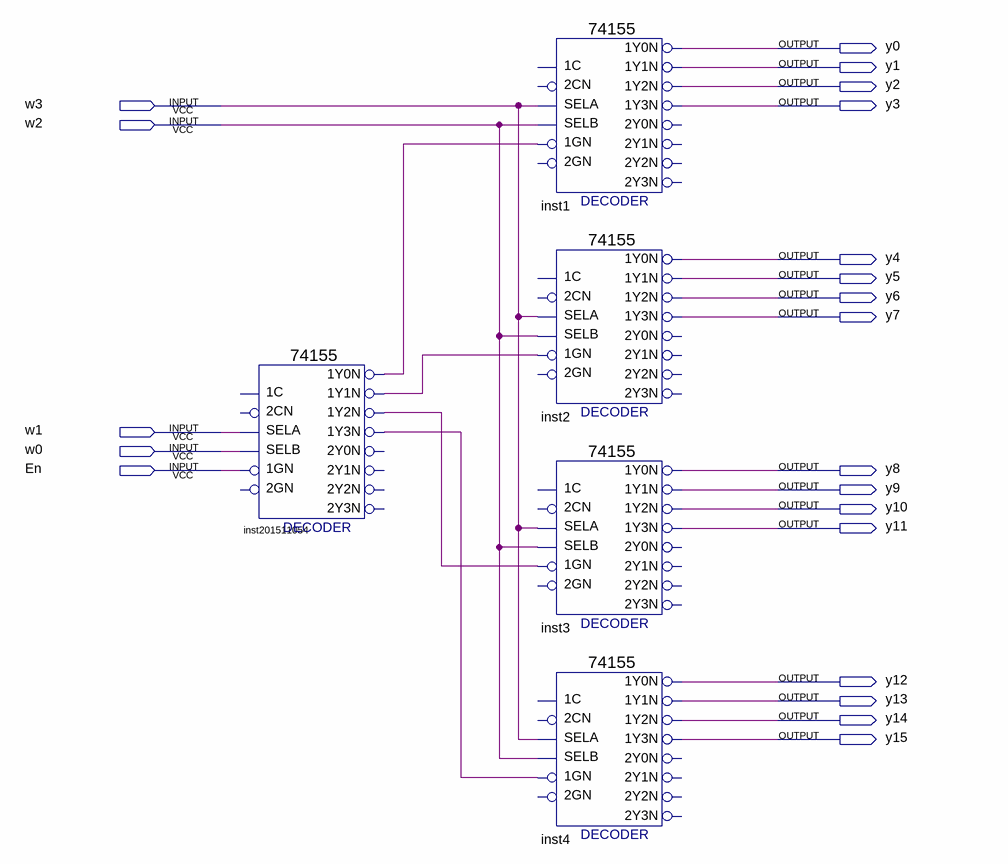
[diagram p0: schematic sheet]
// Quartus schematic lab04_1_4.bdf as structural Verilog: 5 symbols, 21 pins
module lab04_1_4 (
  input  w3,
  input  w2,
  input  w1,
  input  w0,
  input  En,
  output y0,
  output y1,
  output y2,
  output y3,
  output y4,
  output y5,
  output y6,
  output y7,
  output y8,
  output y9,
  output y10,
  output y11,
  output y12,
  output y13,
  output y14,
  output y15
);

  wire inst201511054_1y0n, inst201511054_1y1n, inst201511054_1y2n, inst201511054_1y3n;

  \74155  inst201511054 (
    .SELB(w0), .SELA(w1), .\1GN (En), .\1Y2N (inst201511054_1y2n), .\1Y1N (inst201511054_1y1n),
    .\1Y0N (inst201511054_1y0n), .\1Y3N (inst201511054_1y3n));  // open: 1C, 2CN, 2GN, 2Y1N, 2Y0N, 2Y3N, 2Y2N
  \74155  inst1 (
    .SELB(w2), .SELA(w3), .\1GN (inst201511054_1y0n), .\1Y2N (y2), .\1Y1N (y1), .\1Y0N (y0), .\1Y3N (y3));  // open: 1C, 2CN, 2GN, 2Y1N, 2Y0N, 2Y3N, 2Y2N
  \74155  inst2 (
    .SELB(w2), .SELA(w3), .\1GN (inst201511054_1y1n), .\1Y2N (y6), .\1Y1N (y5), .\1Y0N (y4), .\1Y3N (y7));  // open: 1C, 2CN, 2GN, 2Y1N, 2Y0N, 2Y3N, 2Y2N
  \74155  inst3 (
    .SELB(w2), .SELA(w3), .\1GN (inst201511054_1y2n), .\1Y2N (y10), .\1Y1N (y9), .\1Y0N (y8), .\1Y3N (y11));  // open: 1C, 2CN, 2GN, 2Y1N, 2Y0N, 2Y3N, 2Y2N
  \74155  inst4 (
    .SELB(w2), .SELA(w3), .\1GN (inst201511054_1y3n), .\1Y2N (y14), .\1Y1N (y13), .\1Y0N (y12), .\1Y3N (y15));  // open: 1C, 2CN, 2GN, 2Y1N, 2Y0N, 2Y3N, 2Y2N
endmodule
